# Altium project Hydroscope.PrjPcb (part 1 of 3)
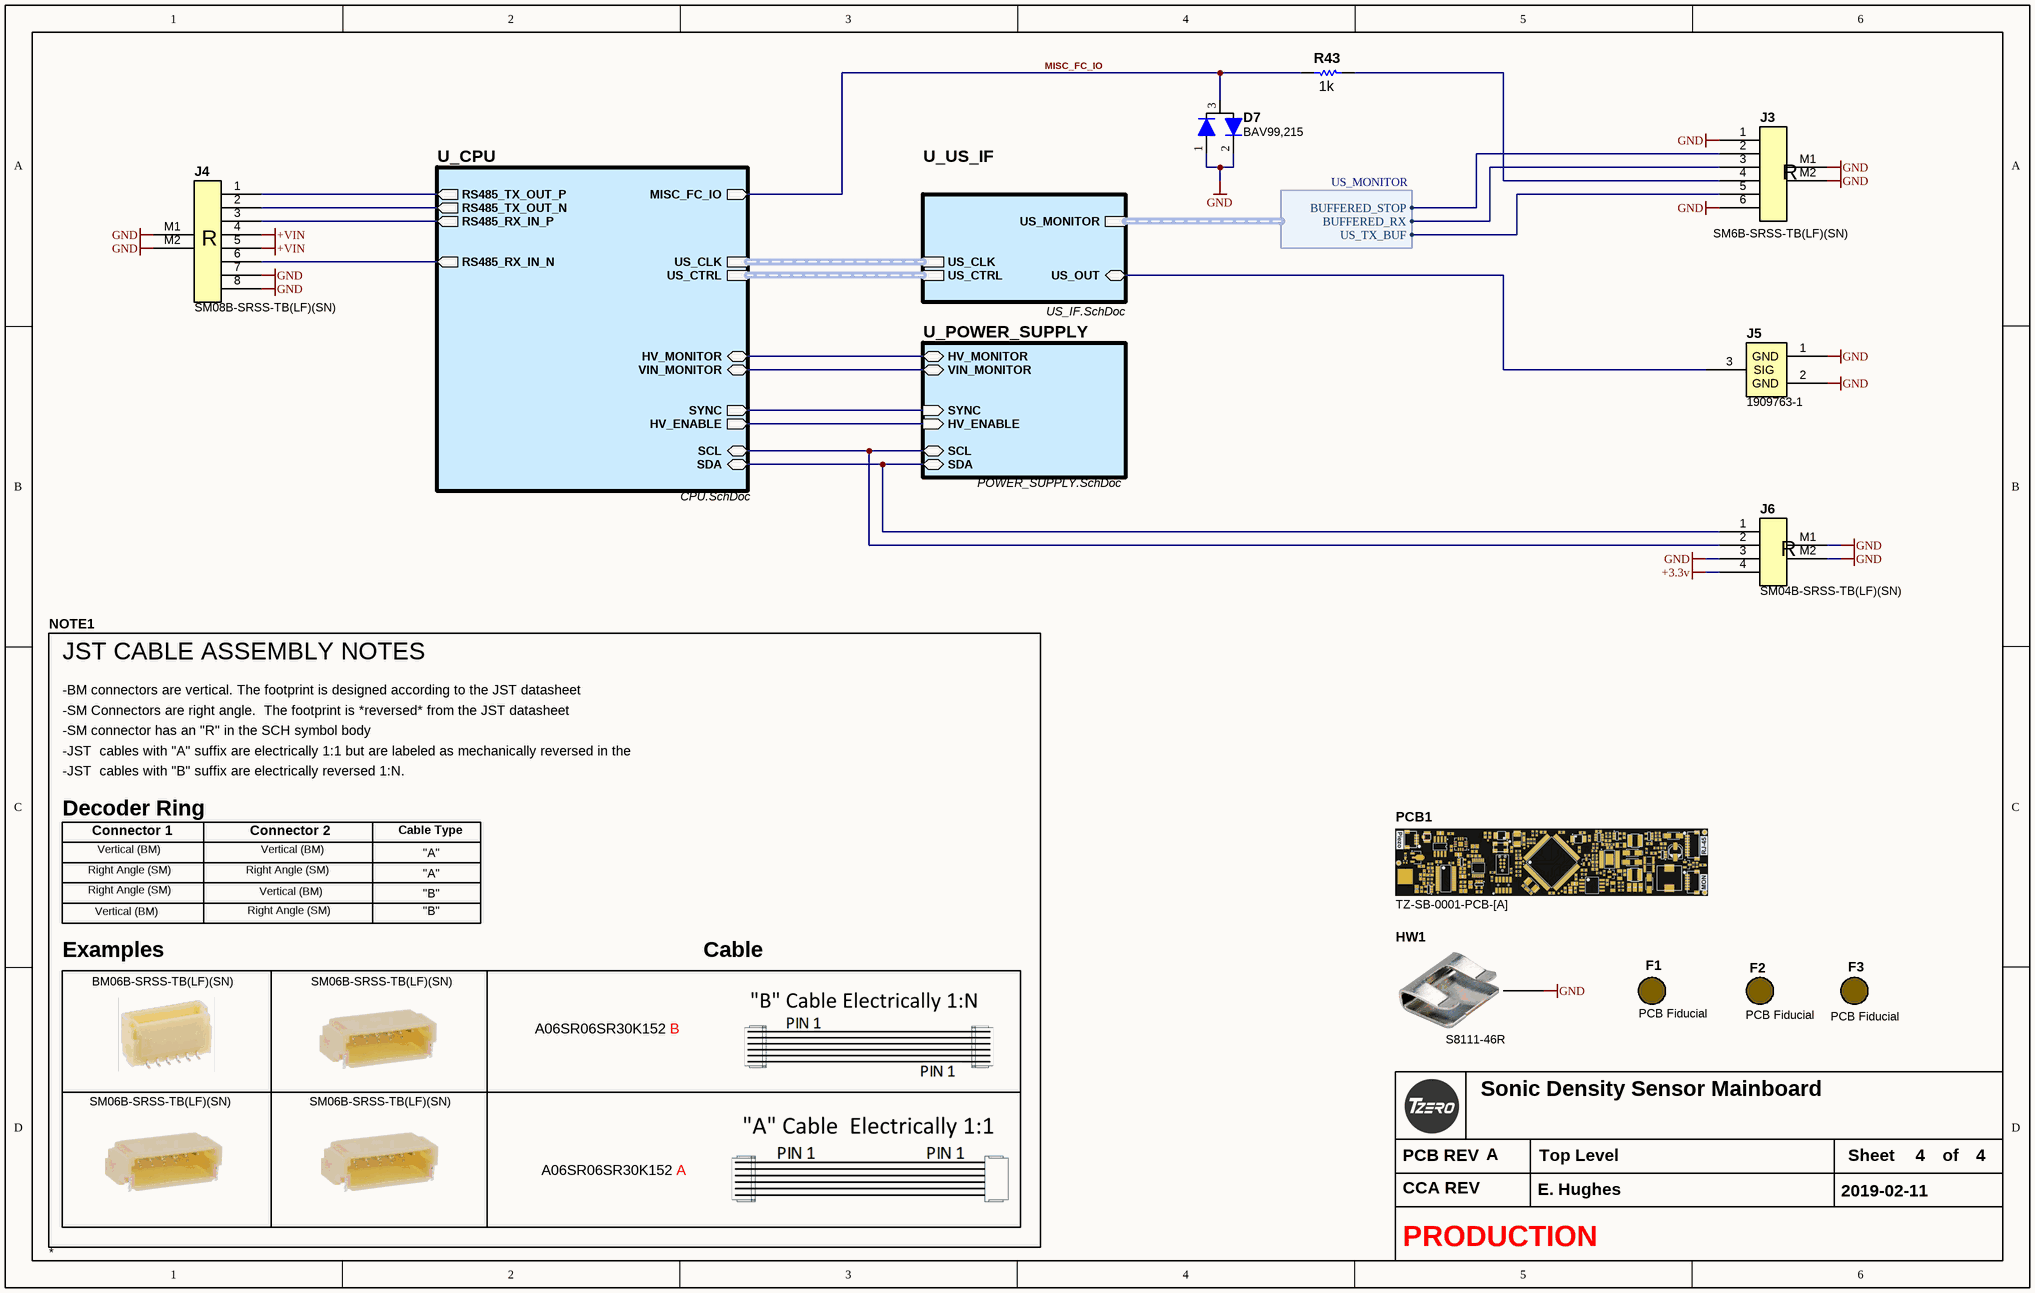
[diagram p0: TOP_LEVEL.SchDoc]
APPROVAL_APPROVED_1: -; APPROVAL_APPROVED_1_DATE: -; APPROVAL_APPROVED_2: -; APPROVAL_APPROVED_2_DATE: -; APPROVAL_CHECKED_DATE: -; APPROVAL_DRAWN: -; APPROVAL_DRAWN_DATE: -; APPROVAL_ENGINEER: -; APPROVAL_ENGINEER_DATE: -; APPROVAL_REVIEWED: -; APPROVAL_REVIEWED_DATE: -; BOM_NOTES_LINE_1: -; BOM_NOTES_LINE_2: -; BOM_NOTES_LINE_3: -; BOM_NOTES_LINE_4: -; CCA_PART_NUMBER: TZ-SB-0001; CCA_TITLE: Sonic Density Sensor Mainboard; PCB_COPPER_WEIGHT_INNER: 1 oz; PCB_COPPER_WEIGHT_OUTER: 1 oz; PCB_DIMENSION_X: X; PCB_DIMENSION_Y: X; PCB_DRC_DATE: X; PCB_FINISH_PLATING: GOLD ENIG; PCB_FINISHED_THICKNESS: 62.5mil; PCB_LAYERS: 4; PCB_MATERIAL: FR4; PCB_MIN_DRILL: 10mil; PCB_MIN_TRACE_SPACE: 6mil; PCB_MIN_TRACE_WIDTH: 6mil; PCB_PART_NUMBER: TZ-SB-0001-PCB; PCB_PRINTOUT_SCALE: 1:1; PCB_SILKSCREEN_COLOR_BOTTOM: WHITE; PCB_SILKSCREEN_COLOR_TOP: WHITE; PCB_SOLDER_MASK_COLOR_BOTTOM: BLACK; PCB_SOLDER_MASK_COLOR_TOP: BLACK; PCB_TITLE: Sonic Density Sensor Mainboard; PCB_VERSION: A; PROJECT_ENGINEER: E. Hughes; PROJECT_STATUS: PRODUCTION; PROJECT_TITLE_LINE_1: Sonic Density Sensor Mainboard; SCH_DATE: 2019-02-11
4 sheets, 167 parts. Net scope: hierarchical (ports join the sheet entries above them; power ports are global).
Board file: TZ-SB-0001-PCB-[A] (HydroScope Mainboard).PcbDoc
Sheets:
  TOP_LEVEL.SchDoc
    U_CPU = CPU.SchDoc
    U_US_IF = US_IF.SchDoc
    U_POWER_SUPPLY = POWER_SUPPLY.SchDoc

## Sheet TOP_LEVEL.SchDoc
size B; DocumentNumber: 1; SheetNumber: 4; SheetTotal: 4; PAGE_TITLE: Top Level

### Parts
D7  BAV99,215  [SOT-23]
F1  PCB Fiducial  [Fiducial 1mm - 2mm]  (no BOM)
F2  PCB Fiducial  [Fiducial 1mm - 2mm]  (no BOM)
F3  PCB Fiducial  [Fiducial 1mm - 2mm]  (no BOM)
HW1  S8111-46R  [S8111-46R]
J3  SM6B-SRSS-TB(LF)(SN)  [SM06B-SRSS-TB(LF)(SN)]
J4  SM08B-SRSS-TB(LF)(SN)  [SM08B-SRSS-TB(LF)(SN)]
J5  1909763-1  [1909763-1]
J6  SM04B-SRSS-TB(LF)(SN)  [SM04B-SRSS-TB(LF)(SN)]
NOTE1  *  (graphical)
PCB1  TZ-SB-0001-PCB-[A]  (mechanical)
R43  1k  [R0603_0.55MM_HD]

### Sub-sheets
U_CPU = CPU.SchDoc: SDA (bidir), HV_ENABLE (out), US_CTRL (harness US_CTRL), SYNC (out), US_CLK (harness US_CLK), SCL (bidir), RS485_TX_OUT_P (out), RS485_TX_OUT_N (out), RS485_RX_IN_N (out), RS485_RX_IN_P (out), HV_MONITOR (bidir), VIN_MONITOR (bidir), MISC_FC_IO (out)
U_POWER_SUPPLY = POWER_SUPPLY.SchDoc: HV_ENABLE (in), SYNC (in), SCL (bidir), SDA (bidir), HV_MONITOR (bidir), VIN_MONITOR (bidir)
U_US_IF = US_IF.SchDoc: US_MONITOR (harness US_MONITOR), US_CLK (harness US_CLK), US_CTRL (harness US_CTRL), US_OUT (bidir)

### Harnesses
US_MONITOR: BUFFERED_STOP, BUFFERED_RX, US_TX_BUF

### Nets
+3.3v: J6.4
+VIN: J4.4 J4.5
GND: D7.1(A) D7.2(C) HW1.1 J3.1 J3.6 J3.M1 J3.M2 J4.7 J4.8 J4.M1 J4.M2 J5.1(GND) J5.2(GND) J6.3 J6.M1 J6.M2
BUFFERED_RX: J3.3 ; sheet U_US_IF/US_MONITOR.BUFFERED_RX
BUFFERED_STOP: J3.2 ; sheet U_US_IF/US_MONITOR.BUFFERED_STOP
DC_DC_SYNC: sheet U_CPU/SYNC, sheet U_POWER_SUPPLY/SYNC
HV_ENABLE: sheet U_CPU/HV_ENABLE, sheet U_POWER_SUPPLY/HV_ENABLE
HV_MONITOR: sheet U_CPU/HV_MONITOR, sheet U_POWER_SUPPLY/HV_MONITOR
MISC_FC_IO: D7.3(AC) R43.2 ; sheet U_CPU/MISC_FC_IO
RS485_RX_IN_N: J4.6 ; sheet U_CPU/RS485_RX_IN_N
RS485_RX_IN_P: J4.3 ; sheet U_CPU/RS485_RX_IN_P
RS485_TX_OUT_N: J4.2 ; sheet U_CPU/RS485_TX_OUT_N
RS485_TX_OUT_P: J4.1 ; sheet U_CPU/RS485_TX_OUT_P
SCL: J6.2 ; sheet U_CPU/SCL, sheet U_POWER_SUPPLY/SCL
SDA: J6.1 ; sheet U_CPU/SDA, sheet U_POWER_SUPPLY/SDA
US_OUT: J5.3(SIG) ; sheet U_US_IF/US_OUT
US_TX_BUF: J3.5 ; sheet U_US_IF/US_MONITOR.US_TX_BUF
VIN_MONITOR: sheet U_CPU/VIN_MONITOR, sheet U_POWER_SUPPLY/VIN_MONITOR
NetJ3_4: J3.4 R43.1

### Buses and harness runs
harness sheet U_CPU/US_CLK = sheet U_US_IF/US_CLK
harness sheet U_CPU/US_CTRL = sheet U_US_IF/US_CTRL

### Notes on the sheet
- PCB REV
- Sheet
- of
- CCA REV
- (in symbol JST_SH_CABLE_ASSEMBLY_NOTES) JST CABLE ASSEMBLY NOTES; -BM connectors are vertical. The footprint is designed according to the JST datasheet; -SM Connectors are right angle.  The footprint is *reversed* from the JST datasheet; -SM connector has an "R" in the SCH symbol body; -JST  cables with "A" suffix are electrically 1:1 but are labeled as mechanically reversed in the; -JST  cables with "B" suffix are electrically reversed 1:N.; Decoder Ring; Cable Type; Connector 1; Connector 2; Vertical (BM); "A"; Right Angle (SM); "B"; Examples; Cable; BM06B-SRSS-TB(LF)(SN); SM06B-SRSS-TB(LF)(SN); A06SR06SR30K152; B; A
- (in symbol SM04B-SRSS-TB(LF)(SN)) R
- (in symbol SM06B-SRSS-TB(LF)(SN)) R
- (in symbol SM08B-SRSS-TB(LF)(SN)) R

### Library data of the parts
D7 = BAV99,215: DIODE ARRAY GP 100V 215MA SOT23; Manufacturer: NXP Semiconductors; Peak Non-Repetitive Surge Current: 4A; Reverse Recovery Time: 4ns; Peak Reverse Current: 500nA; Forward Voltage: 1.25V; Power Dissipation: 250mW; Max Power Dissipation: 250W; Breakdown Voltage: 75V; Supplier 1: Digi-Key; Supplier Part Number 1: 954-BAV99215-CHP; Manufacturer Part Number: BAV99,215; Stock 1: 0; Mount: Surface Mount; Case/Package: TO-236-3; Number of Pins: 3; Weight: 0.01lb; Contact Plating: Tin,Matte; Min Operating Temperature: -65°C; Max Operating Temperature: 150°C; Packaging: Tape and Reel; Forward Current: 215mA; Max Repetitive Reverse Voltage (Vrrm): 100V; Max Surge Current: 4A; Package Quantity: 1; Recovery Time: 4ns; Average Rectified Current: 215mA; Max Forward Surge Current (Ifsm): 4A; Termination: SMD/SMT; Voltage: 100V; Max Reverse Voltage (DC): 100V; Length: 0.25inch; Height: 0.25inch; Width: 0.25inch; Lead Free: Lead Free; REACH SVHC: No SVHC; ComponentLink1URL: https://datasheet.ciiva.com/33728/953882-33728752.pdf; ComponentLink1Description: https://datasheet.ciiva.com/33728/953882-33728752.pdf; ComponentLink2URL: https://datasheet.ciiva.com/904/bav99-ser-904513.pdf; ComponentLink2Description: https://datasheet.ciiva.com/904/bav99-ser-904513.pdf; ComponentLink3URL: https://datasheet.ciiva.com/4434/bav99-ser-4434805.pdf; ComponentLink3Description: https://datasheet.ciiva.com/4434/bav99-ser-4434805.pdf; ComponentLink4URL: https://datasheet.ciiva.com/16474/bav99-ser-16474903.pdf; ComponentLink4Description: https://datasheet.ciiva.com/16474/bav99-ser-16474903.pdf; ComponentLink5URL: https://datasheet.ciiva.com/22628/953882-22628007.pdf; ComponentLink5Description: https://datasheet.ciiva.com/22628/953882-22628007.pdf; ComponentLink6URL: https://datasheet.ciiva.com/36858/953882-36858552.pdf; ComponentLink6Description: https://datasheet.ciiva.com/36858/953882-36858552.pdf; ComponentLink7URL: https://datasheet.ciiva.com/904/bav99-ser-904509.pdf; ComponentLink7Description: https://datasheet.ciiva.com/904/bav99-ser-904509.pdf; ComponentLink8URL: https://datasheet.ciiva.com/904/bav99-ser-904511.pdf; ComponentLink8Description: https://datasheet.ciiva.com/904/bav99-ser-904511.pdf; Value: BAV99,215
F1-F3 = Fiducial: Value: PCB Fiducial
HW1 = S8111-46R: CBL CLIP 1-1.5MM DIA CBL SMD; Manufacturer: Harwin; Wire/Cable Colour: Grey; Material Thickness: 0.008inch; Value: S8111-46R; Supplier 1: Digi-Key; Supplier Part Number 1: 952-1577-1-ND; Manufacturer Part Number: S8111-46R; Stock 1: 36199; Pricing 1: 1=0.27, 10=0.254, 25=0.218, 50=0.1852, 100=0.1779, 250=0.15972, 500=0.15246 (USD); Mount: Solder; Colour: Natural,Silver; Material: Bronze,Copper,Tin; Package Quantity: 1500; Packaging: Tape and Reel; Length: 5mm; Height: 0.081inch; Width: 5mm; Depth: 5mm; REACH SVHC: No SVHC; ComponentLink1URL: https://datasheet.ciiva.com/73/s8111r-73504.pdf; ComponentLink1Description: https://datasheet.ciiva.com/73/s8111r-73504.pdf; ComponentLink2URL: https://datasheet.ciiva.com/5230/s8111r-65574-5230384.pdf; ComponentLink2Description: https://datasheet.ciiva.com/5230/s8111r-65574-5230384.pdf; ComponentLink3URL: https://datasheet.ciiva.com/73/s8111r-73505.pdf; ComponentLink3Description: https://datasheet.ciiva.com/73/s8111r-73505.pdf; ComponentLink4URL: https://datasheet.ciiva.com/1515/1694708-1515016.pdf; ComponentLink4Description: https://datasheet.ciiva.com/1515/1694708-1515016.pdf; ComponentLink5URL: https://datasheet.ciiva.com/30474/0900766b81270b7b-30474510.pdf; ComponentLink5Description: https://datasheet.ciiva.com/30474/0900766b81270b7b-30474510.pdf; Orientation: Straight; Radiation Hardening: No
J3 = SM06B-SRSS-TB(LF)(SN): 6 Positions Header, Shrouded Connector 0.039" (1.00mm) Surface Mount, Right Angle Tin; Manufacturer: JST; Number of Positions: 6; Connector Type: Male Pin; Current Rating: 1A; Voltage Rating: 50V; Contact Resistance: 40mR; Insulation Resistance: 100MR; Gender: Male; Pitch: 1mm; Value: SM6B-SRSS-TB(LF)(SN); Supplier 1: Digi-Key; Supplier Part Number 1: 455-1806-1-ND; Manufacturer Part Number: SM06B-SRSS-TB(LF)(SN); Stock 1: 40560; Pricing 1: 1=0.83, 10=0.782, 100=0.5996, 500=0.5214, 1000=0.4301 (USD); Mount: Surface Mount; Contact Material: Copper,Copper Alloy; Contact Plating: Copper,Tin,Lead; Colour: Natural; Housing Colour: Beige; Housing Material: Polyamide; Material: Polyamide; Min Operating Temperature: -25°C; Max Operating Temperature: 85°C; Number of Rows: 1; Packaging: Tape and Reel; Termination: Solder; Number of Contacts: 6; Orientation: Right Angle; Voltage Rating (AC): 50V; Max Current Rating: 1A; Max Voltage Rating (AC): 50V; Max Voltage Rating (DC): 50V; Length: 8mm; Lead Pitch: 1mm; Depth: 4.95mm; Lead Free: Lead Free; REACH SVHC: No SVHC; Flammability Rating: UL94 V-0; ComponentLink1URL: https://datasheet.ciiva.com/11752/0900766b8082f544-11752176.pdf; ComponentLink1Description: https://datasheet.ciiva.com/11752/0900766b8082f544-11752176.pdf; ComponentLink2URL: https://datasheet.ciiva.com/16217/sm06b-srss-tblfsn-16217552.pdf; ComponentLink2Description: https://datasheet.ciiva.com/16217/sm06b-srss-tblfsn-16217552.pdf; ComponentLink3URL: https://datasheet.ciiva.com/26894/getdatasheetpartid-490708-26894951.pdf; ComponentLink3Description: https://datasheet.ciiva.com/26894/getdatasheetpartid-490708-26894951.pdf; ComponentLink4URL: https://datasheet.ciiva.com/26894/getdatasheetpartid-639890-26894680.pdf; ComponentLink4Description: https://datasheet.ciiva.com/26894/getdatasheetpartid-639890-26894680.pdf; ComponentLink5URL: https://datasheet.ciiva.com/8052/91630-8052281.pdf; ComponentLink5Description: https://datasheet.ciiva.com/8052/91630-8052281.pdf; ComponentLink6URL: https://datasheet.ciiva.com/712/esr-712571.pdf; ComponentLink6Description: https://datasheet.ciiva.com/712/esr-712571.pdf; ComponentLink7URL: https://datasheet.ciiva.com/712/esr-712572.pdf; ComponentLink7Description: https://datasheet.ciiva.com/712/esr-712572.pdf; ComponentLink8URL: https://datasheet.ciiva.com/730/esr-730671.pdf; ComponentLink8Description: https://datasheet.ciiva.com/730/esr-730671.pdf
J4 = SM08B-SRSS-TB(LF)(SN): 8 Positions Header, Shrouded Connector 0.039" (1.00mm) Surface Mount, Right Angle Tin; Manufacturer: JST; Number of Positions: 8; Connector Type: Male Pin; Contact Resistance: 20mR; Current Rating: 1A; Voltage Rating (AC): 50V; Insulation Resistance: 100MR; Gender: Male; Pitch: 0.039inch; Value: SM08B-SRSS-TB(LF)(SN); Supplier 1: Digi-Key; Manufacturer Part Number: SM08B-SRSS-TB(LF)(SN); Stock 1: 51779; Pricing 1: 1=0.9, 10=0.793, 100=0.6838, 500=0.55948, 1000=0.49731 (USD); Mount: Surface Mount; Colour: Natural; Contact Plating: Tin,Lead; Contact Material: Copper,Copper Alloy; Housing Colour: Natural; Housing Material: Nylon; Material: Polyamide; Min Operating Temperature: -25°C; Max Operating Temperature: 85°C; Packaging: Tape and Reel; Number of Rows: 1; Termination: Solder; Number of Contacts: 8; Orientation: Right Angle; Voltage Rating: 50V; Lead Pitch: 1mm; Lead Free: Lead Free; REACH SVHC: No SVHC; Flammability Rating: UL94 V-0; ComponentLink1URL: https://datasheet.ciiva.com/712/esr-712599.pdf; ComponentLink1Description: https://datasheet.ciiva.com/712/esr-712599.pdf; ComponentLink2URL: https://datasheet.ciiva.com/712/esr-712600.pdf; ComponentLink2Description: https://datasheet.ciiva.com/712/esr-712600.pdf; ComponentLink3URL: https://datasheet.ciiva.com/8052/91630-8052285.pdf; ComponentLink3Description: https://datasheet.ciiva.com/8052/91630-8052285.pdf; ComponentLink4URL: https://datasheet.ciiva.com/729/esr-729838.pdf; ComponentLink4Description: https://datasheet.ciiva.com/729/esr-729838.pdf; ComponentLink5URL: https://datasheet.ciiva.com/11752/0900766b8082f54b-11752174.pdf; ComponentLink5Description: https://datasheet.ciiva.com/11752/0900766b8082f54b-11752174.pdf; ComponentLink6URL: https://datasheet.ciiva.com/16487/esr-16487087.pdf; ComponentLink6Description: https://datasheet.ciiva.com/16487/esr-16487087.pdf; Supplier Part Number 1: 455-1808-1-ND
J5 = 1909763-1: CONN UMCC JACK STR 50OHM SMD; Manufacturer: TE Connectivity AMP Connectors; Connector Style: Ultra Miniature Coaxial; Connector Type: Jack, Male Pin; Contact Termination: Solder; Body Material: Copper Alloy; Body Finish: Gold; Dielectric Material: Liquid Crystal Polymer (LCP); Voltage Rating: 60V; Mating Cycles: 30; Insertion Loss: 0.24dB; Value: 1909763-1; Supplier 1: Digi-Key; Supplier Part Number 1: A118077CT-ND; Manufacturer Part Number: 1909763-1; RoHS: RoHS Compliant; Category: Connectors, Interconnects; Stock 1: 75031; Pricing 1: 1=0.49, 10=0.462, 25=0.416, 50=0.3696, 100=0.3542, 250=0.3234, 500=0.308, 1000=0.2541, 2500=0.231 (USD); Packaging: Cut Tape (CT); Part Status: Active; Shield Termination: Solder; Impedance: 50 Ohm; Mounting Type: Surface Mount; Mounting Feature: -; Cable Group: -; Fastening Type: Snap-On; Features: -; Housing Color: Ivory; Ingress Protection: -; Includes: -; Center Contact Plating: Gold; Operating Temperature: -40°C ~ 90°C; Center Contact Material: Copper Alloy; ComponentLink1URL: http://www.te.com/commerce/DocumentDelivery/DDEController?Action=srchrtrv&DocNm=1909763&DocType=Customer+Drawing&DocLang=English; ComponentLink1Description: http://www.te.com/commerce/DocumentDelivery/DDEController?Action=srchrtrv&DocNm=1909763&DocType=Customer+Drawing&DocLang=English
J6 = SM04B-SRSS-TB(LF)(SN): Conn Shrouded Header HDR 4 POS 1mm Solder RA SMD T/R; Manufacturer: JST; Number of Positions: 4; Connector Type: Male Pin; Contact Resistance: 40mR; Max Current Rating: 1A; Max Voltage Rating (AC): 50V; Pitch: 0.039inch; Value: SM04B-SRSS-TB(LF)(SN); Supplier 1: Digi-Key; Manufacturer Part Number: SM04B-SRSS-TB(LF)(SN); Stock 1: 43886; Pricing 1: 1=0.61, 10=0.569, 100=0.436, 500=0.37914, 1000=0.31279 (USD); Mount: Surface Mount; Contact Material: Copper Alloy; Contact Plating: Copper,Tin; Colour: Natural; Housing Colour: Beige; Housing Material: Polyamide; Min Operating Temperature: -25°C; Max Operating Temperature: 85°C; Number of Rows: 1; Termination: Solder; Packaging: Tape and Reel; Orientation: Right Angle; Number of Contacts: 4; Max Voltage Rating (DC): 50V; Length: 6mm; Depth: 4.95mm; Lead Free: Lead Free; ComponentLink1URL: https://datasheet.ciiva.com/26894/getdatasheetpartid-499363-26894945.pdf; ComponentLink1Description: https://datasheet.ciiva.com/26894/getdatasheetpartid-499363-26894945.pdf; ComponentLink2URL: https://datasheet.ciiva.com/26894/getdatasheetpartid-640736-26894676.pdf; ComponentLink2Description: https://datasheet.ciiva.com/26894/getdatasheetpartid-640736-26894676.pdf; ComponentLink3URL: https://datasheet.ciiva.com/16487/jstsm04b-srss-tb-lf-sn-16487222.pdf; ComponentLink3Description: https://datasheet.ciiva.com/16487/jstsm04b-srss-tb-lf-sn-16487222.pdf; Supplier Part Number 1: 455-1804-1-ND
NOTE1 = JST_SH_CABLE_ASSEMBLY_NOTES: Value: *
PCB1 = TZ-SB-0001-PCB-[A]: Raw printed circuit board,  Revision A; Manufacturer: TZero; Value: TZ-SB-0001-PCB-[A]; Manufacturer Part Number: TZ-SB-0001-PCB-[A]
R43 = ERJ-3EKF1001V: RES 1K OHM 1/10W 1% 0603 SMD; Manufacturer: Panasonic Electronic Components; Package Power: 0603  (0.1W); Power (Watts): 0.1W- 1/10W; Temperature Coefficient: ±100ppm/°C; Limiting Element Voltage: 75; Maximum Overload Voltage: 150; Maximum Working Voltage: 10.0V; Substitution Notes: 1k , ±1% , 0603 , AEC-Q200; Value: 1k; Manufacturer Part Number: ERJ-3EKF1001V; ComponentLink1Description: Internal Datasheet; ComponentLink1URL: datasheets\Panasonic Electronic Components\AOA0000CE2.pdf; ComponentLink2Description: External Datasheet; ComponentLink2URL: http://industrial.panasonic.com/www-data/pdf/AOA0000/AOA0000CE2.pdf; Supplier 1: Digi-Key; Supplier Part Number 1: P1.00KHCT-ND; Category: Resistors; Resistance (Ohms): 1k; Composition: Thick Film; Features: -; Tolerance: ±1%; Package: 0603 (1608 Metric); Supplier Package: 0603; Size / Dimension: 0.063" L x 0.031" W (1.60mm x 0.80mm); Height: 0.55MM; Number of Terminations: 2; Packaging: Cut Tape (CT); Sort Value: 1000; Sort Value Package: 603_1000; Ratings: AEC-Q200

## Sheet CPU.SchDoc
size D; Organization: Altium Limited; Address1: 3 Minna Close; Address2: Belrose; Address3: NSW 2085; Address4: Australia; DocumentNumber: 4; SheetNumber: 1; SheetTotal: 4; PAGE_TITLE: CPU
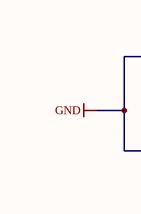
[diagram p1: CPU.SchDoc, top left]
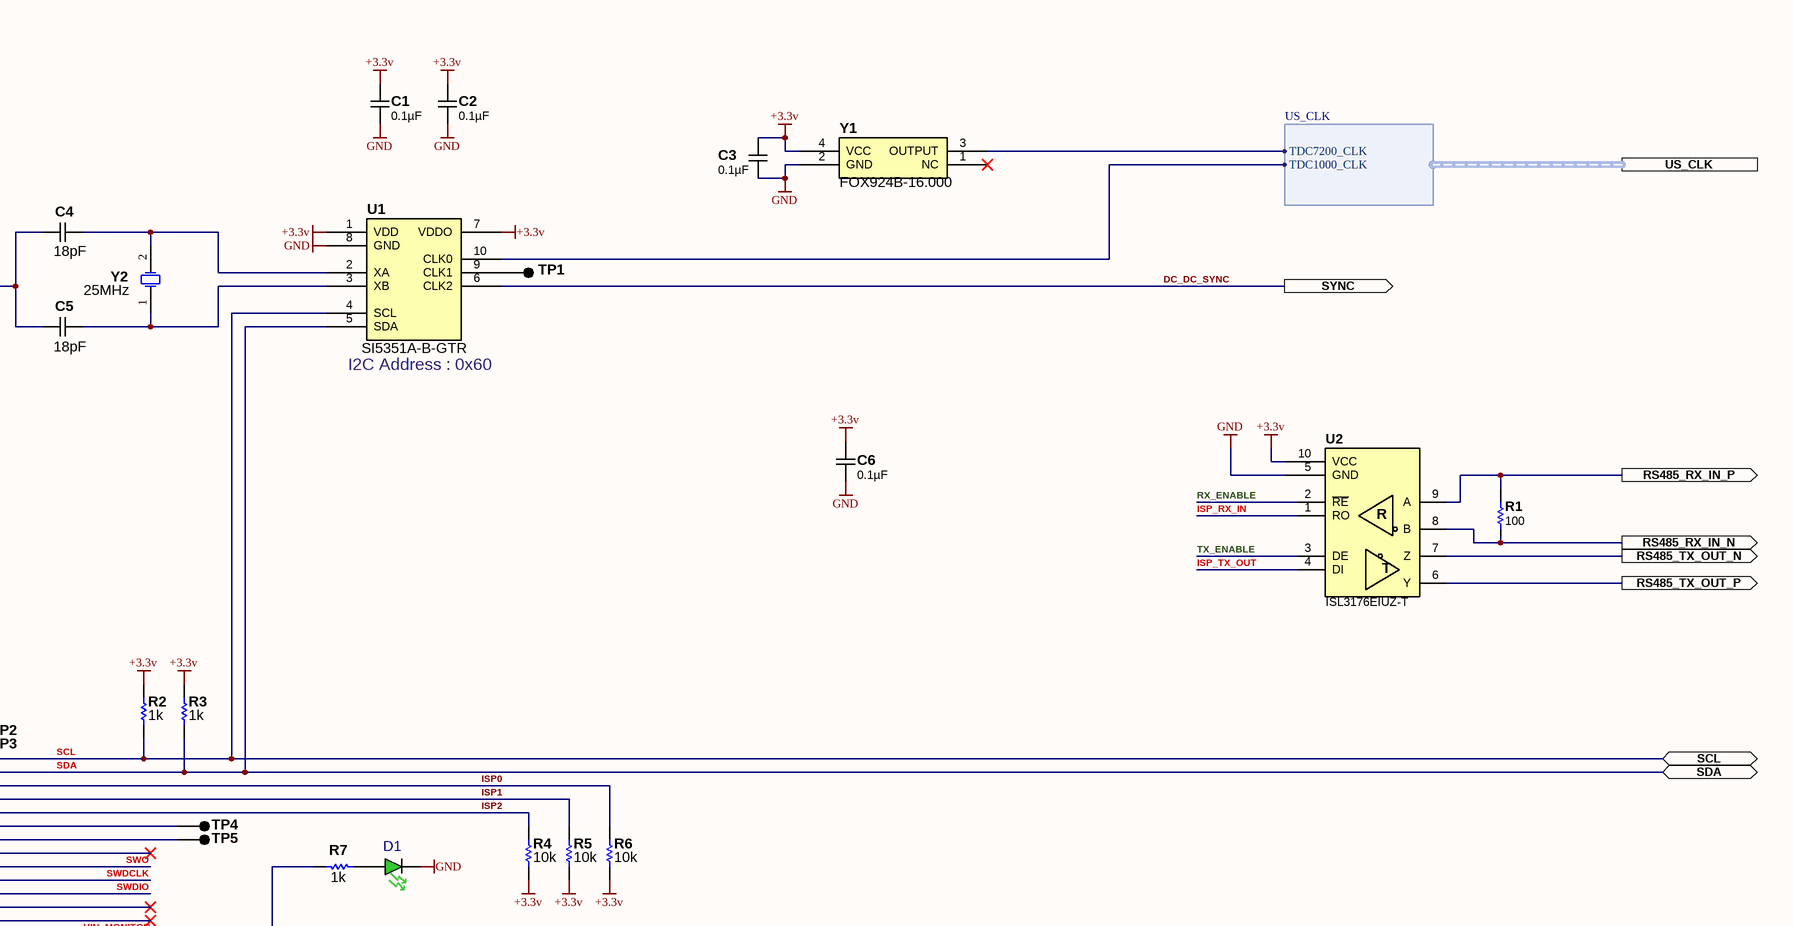
[diagram p2: CPU.SchDoc, top right]
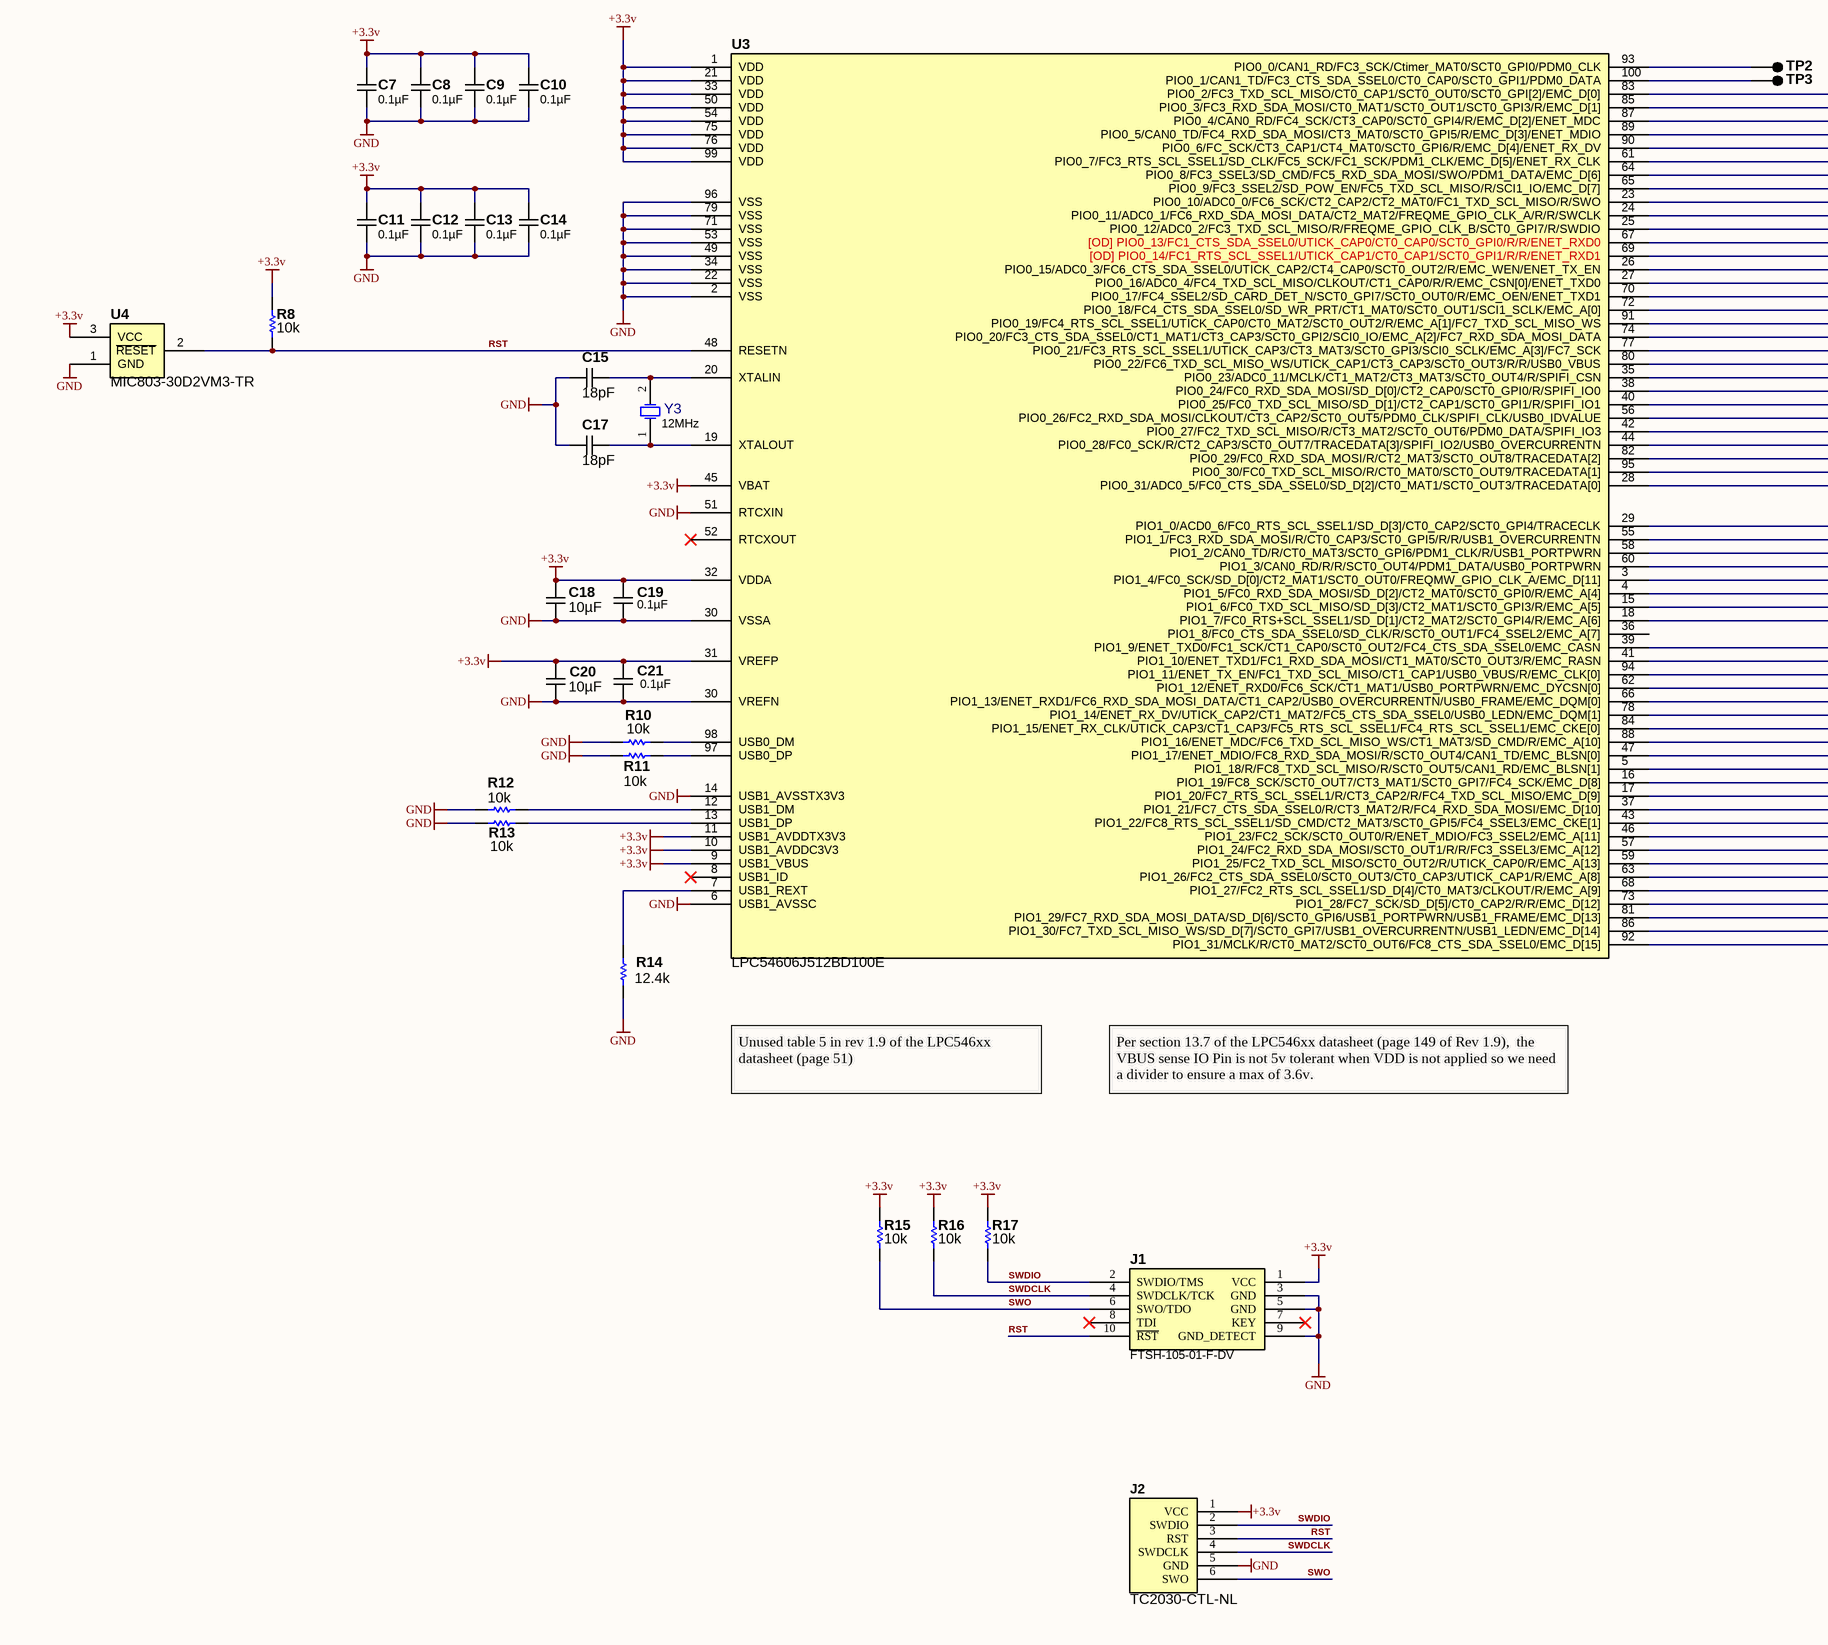
[diagram p3: CPU.SchDoc, bottom left]
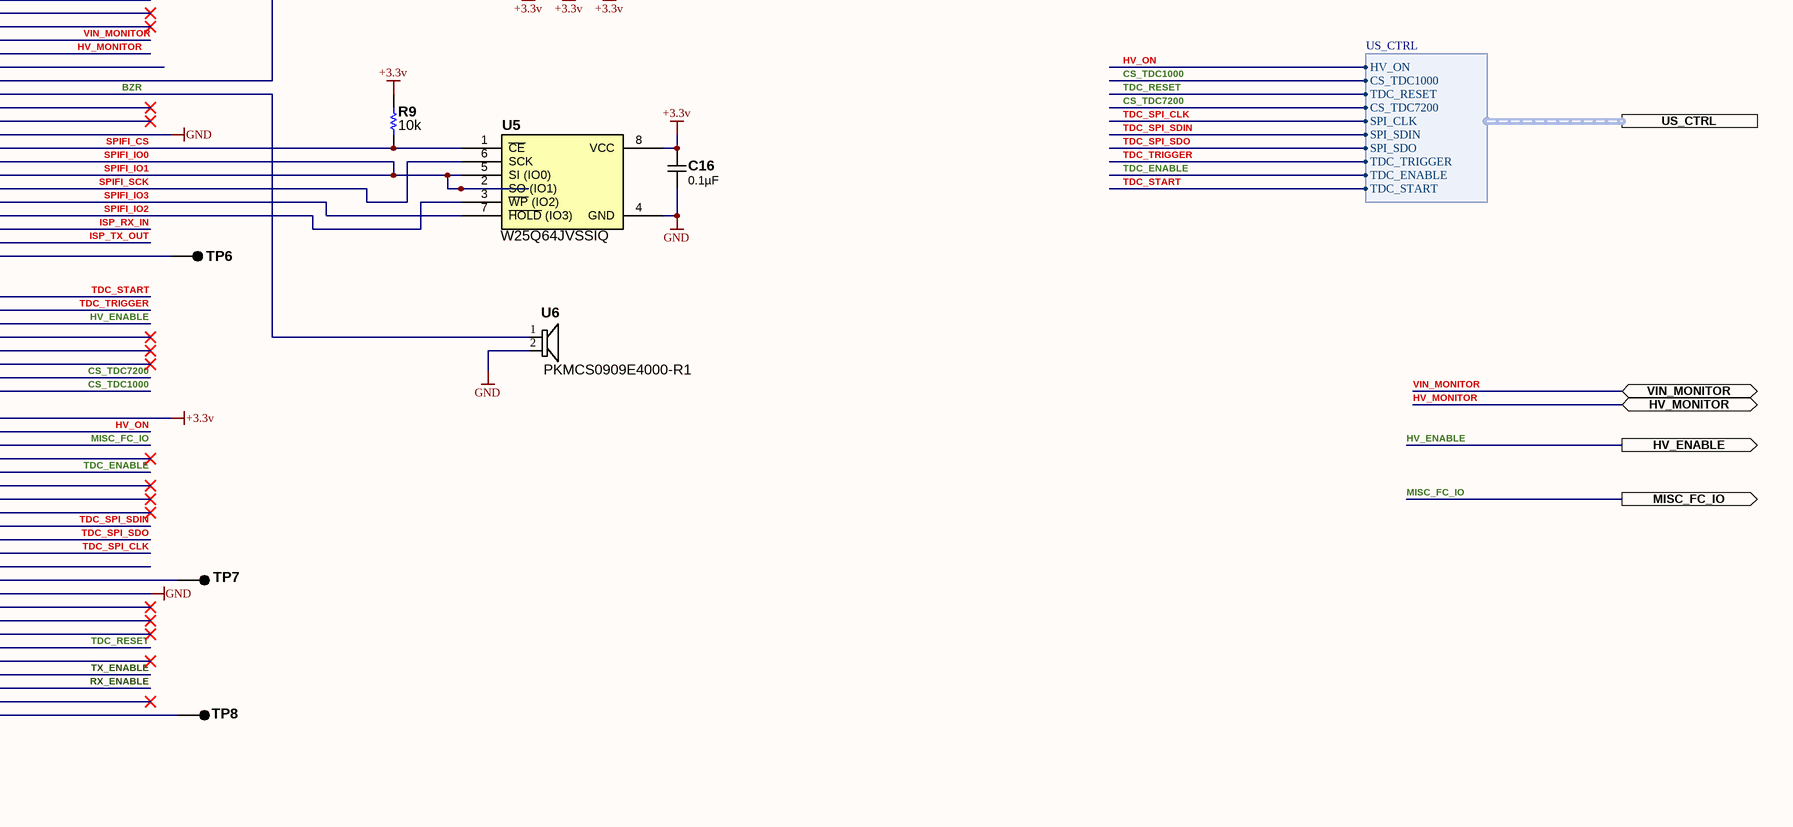
[diagram p4: CPU.SchDoc, bottom right]

### Parts
C1  0.1µF  [C0603_0.90MM_HD]
C2  0.1µF  [C0603_0.90MM_HD]
C3  0.1µF  [C0603_0.90MM_HD]
C4  18pF  [C0603_0.90MM_HD]
C5  18pF  [C0603_0.90MM_HD]
C6  0.1µF  [C0603_0.90MM_HD]
C7  0.1µF  [C0603_0.90MM_HD]
C8  0.1µF  [C0603_0.90MM_HD]
C9  0.1µF  [C0603_0.90MM_HD]
C10  0.1µF  [C0603_0.90MM_HD]
C11  0.1µF  [C0603_0.90MM_HD]
C12  0.1µF  [C0603_0.90MM_HD]
C13  0.1µF  [C0603_0.90MM_HD]
C14  0.1µF  [C0603_0.90MM_HD]
C15  18pF  [C0603_0.90MM_HD]
C16  0.1µF  [C0603_0.90MM_HD]
C17  18pF  [C0603_0.90MM_HD]
C18  10µF  [C0805_1.45MM_HD]
C19  0.1µF  [C0603_0.90MM_HD]
C20  10µF  [C0805_1.45MM_HD]
C21  0.1µF  [C0603_0.90MM_HD]
D1  LED 1.6X0.8MM 570NM GRN CLR SMD  [LED_0603 - GREEN]  (value not drawn)
J1  FTSH-105-01-F-DV  [FTSH-105-04-F-DV - HD]
J2  TC2030‐CTL‐NL  [TC2030 NO LATCH]  (no BOM)
R1  100  [R0603_HD]
R2  1k  [R0603_0.55MM_HD]
R3  1k  [R0603_0.55MM_HD]
R4  10k  [R0603_0.55MM_HD]
R5  10k  [R0603_0.55MM_HD]
R6  10k  [R0603_0.55MM_HD]
R7  1k  [R0603_0.55MM_HD]
R8  10k  [R0603_0.55MM_HD]
R9  10k  [R0603_0.55MM_HD]
R10  10k  [R0603_0.55MM_HD]
R11  10k  [R0603_0.55MM_HD]
R12  10k  [R0603_0.55MM_HD]
R13  10k  [R0603_0.55MM_HD]
R14  12.4k  [R0603_0.55MM_HD]
R15  10k  [R0603_0.55MM_HD]
R16  10k  [R0603_0.55MM_HD]
R17  10k  [R0603_0.55MM_HD]
TP1  SMT_TEST  [SMT_TP - 25]  (value not drawn)  (no BOM)
TP2  SMT_TEST  [SMT_TP - 25]  (value not drawn)  (no BOM)
TP3  SMT_TEST  [SMT_TP - 25]  (value not drawn)  (no BOM)
TP4  SMT_TEST  [SMT_TP - 25]  (value not drawn)  (no BOM)
TP5  SMT_TEST  [SMT_TP - 25]  (value not drawn)  (no BOM)
TP6  SMT_TEST  [SMT_TP - 25]  (value not drawn)  (no BOM)
TP7  SMT_TEST  [SMT_TP - 25]  (value not drawn)  (no BOM)
TP8  SMT_TEST  [SMT_TP - 25]  (value not drawn)  (no BOM)
U1  SI5351A-B-GTR  [10 MSOP]
U2  ISL3176EIUZ-T  [10 MSOP]
U3  LPC54606J512BD100E  [TSQFP50P1600X1600X160-100N]
U4  MIC803-30D2VM3-TR  [SOT-23]
U5  W25Q64JVSSIQ  [SOIC127P830X200-8L]
U6  PKMCS0909E4000-R1  [PKMCS0909E4000-R1]
Y1  FOX924B-16.000  [FOX924]
Y2  25MHz  [ABM3]
Y3  12MHz  [ABM3]

### Ports
HV_ENABLE (out), HV_MONITOR (bidir), MISC_FC_IO (out), RS485_RX_IN_N (out), RS485_RX_IN_P (out), RS485_TX_OUT_N (out), RS485_TX_OUT_P (out), SCL (bidir), SDA (bidir), SYNC (out), US_CLK (harness US_CLK), US_CTRL (harness US_CTRL), VIN_MONITOR (bidir)

### Harnesses
US_CTRL: HV_ON, CS_TDC1000, SPI_CLK, SPI_SDIN, SPI_SDO, CS_TDC7200, TDC_TRIGGER, TDC_ENABLE, TDC_RESET, TDC_START
US_CLK: TDC7200_CLK, TDC1000_CLK

### Nets
+3.3v: C1.2 C2.2 C3.2 C6.1 C7.2 C8.2 C9.2 C10.2 C11.2 C12.2 C13.2 C14.2 C16.2 C18.2 C19.2 C20.2 C21.2 J1.1(VCC) J2.1(VCC) R2.2 R3.2 R4.1 R5.1 R6.1 R8.2 R9.2 R15.2 R16.2 R17.2 U1.1(VDD) U1.7(VDDO) U2.10(VCC) U3.1(VDD) U3.9(USB1_VBUS) U3.10(USB1_AVDDC3V3) U3.11(USB1_AVDDTX3V3) U3.21(VDD) U3.31(VREFP) U3.32(VDDA) U3.33(VDD) U3.39(PIO1_9/ENET_TXD0/FC1_SCK/CT1_CAP0/SCT0_OUT2/FC4_CTS_SDA_SSEL0/EMC_CASN) U3.45(VBAT) U3.50(VDD) U3.54(VDD) U3.75(VDD) U3.76(VDD) U3.99(VDD) U4.3(VCC) U5.8(VCC) Y1.4(VCC)
GND: C1.1 C2.1 C3.1 C4.1 C5.1 C6.2 C7.1 C8.1 C9.1 C10.1 C11.1 C12.1 C13.1 C14.1 C15.1 C16.1 C17.1 C18.1 C19.1 C20.1 C21.1 D1.C J1.3(GND) J1.5(GND) J1.9(GND_DETECT) J2.5(GND) R10.1 R11.1 R12.1 R13.1 R14.1 U1.8(GND) U2.5(GND) U3.2(VSS) U3.6(USB1_AVSSC) U3.14(USB1_AVSSTX3V3) U3.22(VSS) U3.30(VREFN) U3.34(VSS) U3.43(PIO1_22/FC8_RTS_SCL_SSEL1/SD_CMD/CT2_MAT3/SCT0_GPI5/FC4_SSEL3/EMC_CKE[1]) U3.49(VSS) U3.51(RTCXIN) U3.53(VSS) U3.71(VSS) U3.79(VSS) U3.80(PIO0_22/FC6_TXD_SCL_MISO_WS/UTICK_CAP1/CT3_CAP3/SCT0_OUT3/R/R/USB0_VBUS) U3.96(VSS) U4.1(GND) U5.4(GND) U6.2(-) Y1.2(GND)
BZR: U3.91(PIO0_19/FC4_RTS_SCL_SSEL1/UTICK_CAP0/CT0_MAT2/SCT0_OUT2/R/EMC_A[1]/FC7_TXD_SCL_MISO_WS) U6.1(+)
CS_TDC1000: U3.18(PIO1_7/FC0_RTS+SCL_SSEL1/SD_D[1]/CT2_MAT2/SCT0_GPI4/R/EMC_A[6]) ; port US_CTRL.CS_TDC1000
CS_TDC7200: U3.15(PIO1_6/FC0_TXD_SCL_MISO/SD_D[3]/CT2_MAT1/SCT0_GPI3/R/EMC_A[5]) ; port US_CTRL.CS_TDC7200
DC_DC_SYNC: U1.6(CLK2) ; port SYNC
HV_ENABLE: U3.58(PIO1_2/CAN0_TD/R/CT0_MAT3/SCT0_GPI6/PDM1_CLK/R/USB1_PORTPWRN) ; port HV_ENABLE
HV_MONITOR: U3.27(PIO0_16/ADC0_4/FC4_TXD_SCL_MISO/CLKOUT/CT1_CAP0/R/R/EMC_CSN[0]/ENET_TXD0) ; port HV_MONITOR
HV_ON: U3.41(PIO1_10/ENET_TXD1/FC1_RXD_SDA_MOSI/CT1_MAT0/SCT0_OUT3/R/EMC_RASN) ; port US_CTRL.HV_ON
ISP0: R6.2 U3.87(PIO0_4/CAN0_RD/FC4_SCK/CT3_CAP0/SCT0_GPI4/R/EMC_D[2]/ENET_MDC)
ISP1: R5.2 U3.89(PIO0_5/CAN0_TD/FC4_RXD_SDA_MOSI/CT3_MAT0/SCT0_GPI5/R/EMC_D[3]/ENET_MDIO)
ISP2: R4.2 U3.90(PIO0_6/FC_SCK/CT3_CAP1/CT4_MAT0/SCT0_GPI6/R/EMC_D[4]/ENET_RX_DV)
ISP_RX_IN: U2.1(RO) U3.82(PIO0_29/FC0_RXD_SDA_MOSI/R/CT2_MAT3/SCT0_OUT8/TRACEDATA[2])
ISP_TX_OUT: U2.4(DI) U3.95(PIO0_30/FC0_TXD_SCL_MISO/R/CT0_MAT0/SCT0_OUT9/TRACEDATA[1])
MISC_FC_IO: U3.94(PIO1_11/ENET_TX_EN/FC1_TXD_SCL_MISO/CT1_CAP1/USB0_VBUS/R/EMC_CLK[0]) ; port MISC_FC_IO
RS485_RX_IN_N: R1.1 U2.8(B) ; port RS485_RX_IN_N
RS485_RX_IN_P: R1.2 U2.9(A) ; port RS485_RX_IN_P
RS485_TX_OUT_N: U2.7(Z) ; port RS485_TX_OUT_N
RS485_TX_OUT_P: U2.6(Y) ; port RS485_TX_OUT_P
RST: J1.10(~{RST}) J2.3(RST) R8.1 U3.48(RESETN) U4.2(~{RESET})
RX_ENABLE: U2.2(~{RE}) U3.81(PIO1_29/FC7_RXD_SDA_MOSI_DATA/SD_D[6]/SCT0_GPI6/USB1_PORTPWRN/USB1_FRAME/EMC_D[13])
SCL: R2.1 U1.4(SCL) U3.83(PIO0_2/FC3_TXD_SCL_MISO/CT0_CAP1/SCT0_OUT0/SCT0_GPI[2]/EMC_D[0]) ; port SCL
SDA: R3.1 U1.5(SDA) U3.85(PIO0_3/FC3_RXD_SDA_MOSI/CT0_MAT1/SCT0_OUT1/SCT0_GPI3/R/EMC_D[1]) ; port SDA
SPIFI_CS: R9.1 U3.35(PIO0_23/ADC0_11/MCLK/CT1_MAT2/CT3_MAT3/SCT0_OUT4/R/SPIFI_CSN) U5.1(~{CE})
SPIFI_IO0: U3.38(PIO0_24/FC0_RXD_SDA_MOSI/SD_D[0]/CT2_CAP0/SCT0_GPI0/R/SPIFI_IO0) U3.40(PIO0_25/FC0_TXD_SCL_MISO/SD_D[1]/CT2_CAP1/SCT0_GPI1/R/SPIFI_IO1) U5.2(SO_(IO1)) U5.5(SI_(IO0))  [also labelled SPIFI_IO1]
SPIFI_IO2: U3.44(PIO0_28/FC0_SCK/R/CT2_CAP3/SCT0_OUT7/TRACEDATA[3]/SPIFI_IO2/USB0_OVERCURRENTN) U5.3(~{WP}_(IO2))
SPIFI_IO3: U3.42(PIO0_27/FC2_TXD_SCL_MISO/R/CT3_MAT2/SCT0_OUT6/PDM0_DATA/SPIFI_IO3) U5.7(~{HOLD}_(IO3))
SPIFI_SCK: U3.56(PIO0_26/FC2_RXD_SDA_MOSI/CLKOUT/CT3_CAP2/SCT0_OUT5/PDM0_CLK/SPIFI_CLK/USB0_IDVALUE) U5.6(SCK)
SWDCLK: J1.4(SWDCLK/TCK) J2.4(SWDCLK) R16.1 U3.24(PIO0_11/ADC0_1/FC6_RXD_SDA_MOSI_DATA/CT2_MAT2/FREQME_GPIO_CLK_A/R/R/SWCLK)
SWDIO: J1.2(SWDIO/TMS) J2.2(SWDIO) R17.1 U3.25(PIO0_12/ADC0_2/FC3_TXD_SCL_MISO/R/FREQME_GPIO_CLK_B/SCT0_GPI7/R/SWDIO)
SWO: J1.6(SWO/TDO) J2.6(SWO) R15.1 U3.23(PIO0_10/ADC0_0/FC6_SCK/CT2_CAP2/CT2_MAT0/FC1_TXD_SCL_MISO/R/SWO)
TDC_ENABLE: U3.66(PIO1_13/ENET_RXD1/FC6_RXD_SDA_MOSI_DATA/CT1_CAP2/USB0_OVERCURRENTN/USB0_FRAME/EMC_DQM[0]) ; port US_CTRL.TDC_ENABLE
TDC_RESET: U3.63(PIO1_26/FC2_CTS_SDA_SSEL0/SCT0_OUT3/CT0_CAP3/UTICK_CAP1/R/EMC_A[8]) ; port US_CTRL.TDC_RESET
TDC_SPI_CLK: U3.16(PIO1_19/FC8_SCK/SCT0_OUT7/CT3_MAT1/SCT0_GPI7/FC4_SCK/EMC_D[8]) ; port US_CTRL.SPI_CLK  [project net SPI_CLK]
TDC_SPI_SDIN: U3.47(PIO1_17/ENET_MDIO/FC8_RXD_SDA_MOSI/R/SCT0_OUT4/CAN1_TD/EMC_BLSN[0]) ; port US_CTRL.SPI_SDIN  [project net SPI_SDIN]
TDC_SPI_SDO: U3.5(PIO1_18/R/FC8_TXD_SCL_MISO/R/SCT0_OUT5/CAN1_RD/EMC_BLSN[1]) ; port US_CTRL.SPI_SDO  [project net SPI_SDO]
TDC_START: U3.29(PIO1_0/ACD0_6/FC0_RTS_SCL_SSEL1/SD_D[3]/CT0_CAP2/SCT0_GPI4/TRACECLK) ; port US_CTRL.TDC_START  [project net START]
TDC_TRIGGER: U3.55(PIO1_1/FC3_RXD_SDA_MOSI/R/CT0_CAP3/SCT0_GPI5/R/R/USB1_OVERCURRENTN) ; port US_CTRL.TDC_TRIGGER
TX_ENABLE: U2.3(DE) U3.73(PIO1_28/FC7_SCK/SD_D[5]/CT0_CAP2/R/R/EMC_D[12])
VIN_MONITOR: U3.26(PIO0_15/ADC0_3/FC6_CTS_SDA_SSEL0/UTICK_CAP2/CT4_CAP0/SCT0_OUT2/R/EMC_WEN/ENET_TX_EN) ; port VIN_MONITOR
NetC4_2: C4.2 U1.2(XA) Y2.2(OSC2)
NetC5_2: C5.2 U1.3(XB) Y2.1(OSC1)
NetC15_2: C15.2 U3.20(XTALIN) Y3.2(OSC2)
NetC17_2: C17.2 U3.19(XTALOUT) Y3.1(OSC1)
NetD1_A: D1.A R7.1
NetR7_2: R7.2 U3.72(PIO0_18/FC4_CTS_SDA_SSEL0/SD_WR_PRT/CT1_MAT0/SCT0_OUT1/SCI1_SCLK/EMC_A[0])
NetR10_2: R10.2 U3.98(USB0_DM)
NetR11_2: R11.2 U3.97(USB0_DP)
NetR12_2: R12.2 U3.12(USB1_DM)
NetR13_2: R13.2 U3.13(USB1_DP)
NetR14_2: R14.2 U3.7(USB1_REXT)
NetTP1_1: TP1.1 U1.9(CLK1)
NetTP2_1: TP2.1 U3.93(PIO0_0/CAN1_RD/FC3_SCK/Ctimer_MAT0/SCT0_GPI0/PDM0_CLK)
NetTP3_1: TP3.1 U3.100(PIO0_1/CAN1_TD/FC3_CTS_SDA_SSEL0/CT0_CAP0/SCT0_GPI1/PDM0_DATA)
NetTP4_1: TP4.1 U3.61(PIO0_7/FC3_RTS_SCL_SSEL1/SD_CLK/FC5_SCK/FC1_SCK/PDM1_CLK/EMC_D[5]/ENET_RX_CLK)
NetTP5_1: TP5.1 U3.64(PIO0_8/FC3_SSEL3/SD_CMD/FC5_RXD_SDA_MOSI/SWO/PDM1_DATA/EMC_D[6])
NetTP6_1: TP6.1 U3.28(PIO0_31/ADC0_5/FC0_CTS_SDA_SSEL0/SD_D[2]/CT0_MAT1/SCT0_OUT3/TRACEDATA[0])
NetTP7_1: TP7.1 U3.37(PIO1_21/FC7_CTS_SDA_SSEL0/R/CT3_MAT2/R/FC4_RXD_SDA_MOSI/EMC_D[10])
NetTP8_1: TP8.1 U3.92(PIO1_31/MCLK/R/CT0_MAT2/SCT0_OUT6/FC8_CTS_SDA_SSEL0/EMC_D[15])
NetU1_10: U1.10(CLK0) ; port US_CLK.TDC1000_CLK
NetU10_5: Y1.3(OUTPUT) ; port US_CLK.TDC7200_CLK

Not connected (* = marked no-connect by the designer): J1 7(KEY)* 8(TDI)*; U3 3(PIO1_4/FC0_SCK/SD_D[0]/CT2_MAT1/SCT0_OUT0/FREQMW_GPIO_CLK_A/EMC_D[11])* 4(PIO1_5/FC0_RXD_SDA_MOSI/SD_D[2]/CT2_MAT0/SCT0_GPI0/R/EMC_A[4])* 8(USB1_ID)* 17(PIO1_20/FC7_RTS_SCL_SSEL1/R/CT3_CAP2/R/FC4_TXD_SCL_MISO/EMC_D[9]) 36(PIO1_8/FC0_CTS_SDA_SSEL0/SD_CLK/R/SCT0_OUT1/FC4_SSEL2/EMC_A[7]) 46(PIO1_23/FC2_SCK/SCT0_OUT0/R/ENET_MDIO/FC3_SSEL2/EMC_A[11])* 52(RTCXOUT)* 57(PIO1_24/FC2_RXD_SDA_MOSI/SCT0_OUT1/R/R/FC3_SSEL3/EMC_A[12])* 59(PIO1_25/FC2_TXD_SCL_MISO/SCT0_OUT2/R/UTICK_CAP0/R/EMC_A[13])* 60(PIO1_3/CAN0_RD/R/R/SCT0_OUT4/PDM1_DATA/USB0_PORTPWRN)* 62(PIO1_12/ENET_RXD0/FC6_SCK/CT1_MAT1/USB0_PORTPWRN/EMC_DYCSN[0])* 65(PIO0_9/FC3_SSEL2/SD_POW_EN/FC5_TXD_SCL_MISO/R/SCI1_IO/EMC_D[7])* 67([OD]_PIO0_13/FC1_CTS_SDA_SSEL0/UTICK_CAP0/CT0_CAP0/SCT0_GPI0/R/R/ENET_RXD0)* 68(PIO1_27/FC2_RTS_SCL_SSEL1/SD_D[4]/CT0_MAT3/CLKOUT/R/EMC_A[9])* 69([OD]_PIO0_14/FC1_RTS_SCL_SSEL1/UTICK_CAP1/CT0_CAP1/SCT0_GPI1/R/R/ENET_RXD1)* 70(PIO0_17/FC4_SSEL2/SD_CARD_DET_N/SCT0_GPI7/SCT0_OUT0/R/EMC_OEN/ENET_TXD1) 74(PIO0_20/FC3_CTS_SDA_SSEL0/CT1_MAT1/CT3_CAP3/SCT0_GPI2/SCI0_IO/EMC_A[2]/FC7_RXD_SDA_MOSI_DATA)* 77(PIO0_21/FC3_RTS_SCL_SSEL1/UTICK_CAP3/CT3_MAT3/SCT0_GPI3/SCI0_SCLK/EMC_A[3]/FC7_SCK)* 78(PIO1_14/ENET_RX_DV/UTICK_CAP2/CT1_MAT2/FC5_CTS_SDA_SSEL0/USB0_LEDN/EMC_DQM[1])* 84(PIO1_15/ENET_RX_CLK/UTICK_CAP3/CT1_CAP3/FC5_RTS_SCL_SSEL1/FC4_RTS_SCL_SSEL1/EMC_CKE[0])* 86(PIO1_30/FC7_TXD_SCL_MISO_WS/SD_D[7]/SCT0_GPI7/USB1_OVERCURRENTN/USB1_LEDN/EMC_D[14])* 88(PIO1_16/ENET_MDC/FC6_TXD_SCL_MISO_WS/CT1_MAT3/SD_CMD/R/EMC_A[10])*; Y1 1(NC)*

### Notes on the sheet
- (near U1) I2C Address : 0x60
- Unused table 5 in rev 1.9 of the LPC546xx datasheet (page 51)
- Per section 13.7 of the LPC546xx datasheet (page 149 of Rev 1.9),  the VBUS sense IO Pin is not 5v tolerant when VDD is not applied so we need a divider to ensure a max of 3.6v.
- PCB REV
- CCA REV
- Sheet
- of
- (in symbol ISL3176EIUZ-T) R; T

### Library data of the parts
C1-C3 C6-C14 C16 C19 C21 = CGA3E2X7R1H104K080AE: CAP CER 0.1UF 50V X7R 0603; Manufacturer: TDK Corporation; Tolerance: ±10%; Substitution Notes: 0.1µF , 50V , ±10% , X7R , -55°C ~ 125°C , AEC-Q200 , 0603; Value: 0.1µF; Temperature Coefficient: X7R; Manufacturer Part Number: CGA3E2X7R1H104K080AE; ComponentLink1Description: Datasheet (Internal); ComponentLink1URL: datasheets\TDK\mlcc_automotive_general_en.pdf; ComponentLink2Description: Datasheet (External); ComponentLink2URL: https://product.tdk.com/info/en/catalog/datasheets/mlcc_automotive_general_en.pdf; Supplier 1: Digikey; Supplier Part Number 1: 445-15957-1-ND; Category: Capacitors; Voltage - Rated: 50V; Operating Temperature: -55°C ~ 125°C; Ratings: AEC-Q200; Package: 0603; Thickness (Max): 0.90MM; Features: Soft Termination
C4 C5 C15 C17 = CGA3E2C0G1H180J080AA: CAP CER 18PF 50V C0G 0603; Manufacturer: TDK Corporation; Temperature Coefficient: C0G, NP0; Tolerance: ±5%; Substitution Notes: 18pF , 50V , ±5% , C0G, NP0 , -55°C ~ 125°C , AEC-Q200 , 0603; Value: 18pF; Manufacturer Part Number: CGA3E2C0G1H180J080AA; ComponentLink1Description: Datasheet (Internal); ComponentLink1URL: datasheets\TDK\mlcc_automotive_general_en.pdf; ComponentLink2Description: Datasheet (External); ComponentLink2URL: https://product.tdk.com/info/en/catalog/datasheets/mlcc_automotive_general_en.pdf; Supplier 1: Digikey; Supplier Part Number 1: 445-5631-1-ND; Category: Capacitors; Voltage - Rated: 50V; Operating Temperature: -55°C ~ 125°C; Ratings: AEC-Q200; Package: 0603; Thickness (Max): 0.90MM; Features: -
C18 C20 = CGA4J1X7R0J106K125AC: CAP CER 10UF 6.3V X7R 0805; Manufacturer: TDK Corporation; Tolerance: ±10%; Substitution Notes: 10µF , 6.3V , ±10% , X7R , -55°C ~ 125°C , AEC-Q200 , 0805; Value: 10µF; Temperature Coefficient: X7R; Manufacturer Part Number: CGA4J1X7R0J106K125AC; ComponentLink1Description: Datasheet (Internal); ComponentLink1URL: datasheets\TDK\mlcc_automotive_general_en.pdf; ComponentLink2Description: Datasheet (External); ComponentLink2URL: https://product.tdk.com/info/en/catalog/datasheets/mlcc_automotive_general_en.pdf; Supplier 1: Digikey; Supplier Part Number 1: 445-6971-1-ND; Category: Capacitors; Voltage - Rated: 6.3V; Operating Temperature: -55°C ~ 125°C; Ratings: AEC-Q200; Package: 0805; Thickness (Max): 1.45MM; Features: -
D1 = APT1608CGCK: Manufacturer: Kingbright Corp; Wavelength - Peak: 574nm; Millicandela Rating: 50mcd; Voltage - Forward (Vf) Typ: 2.1V; Viewing Angle: 120°; Color: Green; Current - Test: 20mA; Lens Type: Clear; Lens Style/Size: Rectangle with Flat Top, 1.2mm x 0.8mm; Value: LED 1.6X0.8MM 570NM GRN CLR SMD; Manufacturer Part Number: APT1608CGCK; RoHS: RoHS Compliant; Wavelength - Dominant: 570nm; Size / Dimension: 1.60mm L x 0.80mm W; Package / Case: 0603 (1608 Metric); Mounting Type: Surface Mount; Packaging: Tape & Reel (TR); Supplier 1: Digi-Key; Supplier Part Number 1: 754-1116-1-ND; Category: Optoelectronics; Stock 1: 89450; Pricing 1: 1=0.2, 10=0.153, 25=0.1224, 100=0.1105, 250=0.102, 500=0.0918 (USD); Height: 0.75mm; Luminous Flux @ Current - Test: -; ComponentLink1URL: http://www.us.kingbright.com/images/catalog/SPEC/APT1608CGCK.pdf; ComponentLink1Description: http://www.us.kingbright.com/images/catalog/SPEC/APT1608CGCK.pdf; Supplier 2: Digikey; Supplier Part Number 2: 160-2162-1-ND
J1 = CORTEX-DEBUG: SAMTEC - FTSH-105-01-F-DV - .050 X .050; Value: FTSH-105-01-F-DV; Supplier 1: Newark; Manufacturer: SAMTEC; Manufacturer Part Number: FTSH-105-01-F-DV; Category: Connectors; Stock 1: 0; Pricing 1: 1=0.974, 25000=0.835, 50000=0.774 (USD); Supplier Part Number 1: 01R3399
J2 = TC2030‐CTL‐NL: Tag Connect Pads - No latching Clips - ARM; Value: TC2030‐CTL‐NL
R1 = ERJ-3EKF1000V: RES 100 OHM 1/10W 1% 0603 SMD; Manufacturer: Panasonic Electronic Components; Package Power: 0603  (0.1W); Power (Watts): 0.1W- 1/10W; Temperature Coefficient: ±100ppm/°C; Limiting Element Voltage: 75; Maximum Overload Voltage: 150; Maximum Working Voltage: 3.2V; Substitution Notes: 100 , ±1% , 0603 , AEC-Q200; Value: 100; Manufacturer Part Number: ERJ-3EKF1000V; ComponentLink1Description: Internal Datasheet; ComponentLink1URL: datasheets\Panasonic Electronic Components\AOA0000CE2.pdf; ComponentLink2Description: External Datasheet; ComponentLink2URL: http://industrial.panasonic.com/www-data/pdf/AOA0000/AOA0000CE2.pdf; Stocked: 0; Supplier 1: Digi-Key; Supplier Part Number 1: P100HCT-ND; Category: Resistors; Resistance (Ohms): 100; Composition: Thick Film; Features: -; Tolerance: ±1%; Package: 0603 (1608 Metric); Supplier Package: 0603; Size / Dimension: 0.063" L x 0.031" W (1.60mm x 0.80mm); Height: 0.55MM; Number of Terminations: 2; Packaging: Cut Tape (CT); Sort Value: 100; Sort Value Package: 603_100; Ratings: AEC-Q200
R2 R3 R7 = ERJ-3EKF1001V: as R43 on sheet TOP_LEVEL; Value: 1k; Manufacturer Part Number: ERJ-3EKF1001V; ComponentLink1Description: Internal Datasheet; ComponentLink1URL: datasheets\Panasonic Electronic Components\AOA0000CE2.pdf; ComponentLink2Description: External Datasheet; ComponentLink2URL: http://industrial.panasonic.com/www-data/pdf/AOA0000/AOA0000CE2.pdf; Supplier 1: Digi-Key; Supplier Part Number 1: P1.00KHCT-ND; Category: Resistors; Resistance (Ohms): 1k; Composition: Thick Film; Features: -; Tolerance: ±1%; Package: 0603 (1608 Metric); Supplier Package: 0603; Size / Dimension: 0.063" L x 0.031" W (1.60mm x 0.80mm); Height: 0.55MM; Number of Terminations: 2; Packaging: Cut Tape (CT); Sort Value: 1000; Sort Value Package: 603_1000; Ratings: AEC-Q200
R4-R6 R8-R13 R15-R17 = ERJ-3EKF1002V: RES 10K OHM 1/10W 1% 0603 SMD; Manufacturer: Panasonic Electronic Components; Package Power: 0603  (0.1W); Power (Watts): 0.1W- 1/10W; Temperature Coefficient: ±100ppm/°C; Limiting Element Voltage: 75; Maximum Overload Voltage: 150; Maximum Working Voltage: 31.6V; Substitution Notes: 10k , ±1% , 0603 , AEC-Q200; Value: 10k; Manufacturer Part Number: ERJ-3EKF1002V; ComponentLink1Description: Internal Datasheet; ComponentLink1URL: datasheets\Panasonic Electronic Components\AOA0000CE2.pdf; ComponentLink2Description: External Datasheet; ComponentLink2URL: http://industrial.panasonic.com/www-data/pdf/AOA0000/AOA0000CE2.pdf; Supplier 1: Digi-Key; Supplier Part Number 1: P10.0KHCT-ND; Category: Resistors; Resistance (Ohms): 10k; Composition: Thick Film; Features: -; Tolerance: ±1%; Package: 0603 (1608 Metric); Supplier Package: 0603; Size / Dimension: 0.063" L x 0.031" W (1.60mm x 0.80mm); Height: 0.55MM; Number of Terminations: 2; Packaging: Cut Tape (CT); Sort Value: 10000; Sort Value Package: 603_10000; Ratings: AEC-Q200
R14 = ERJ-3EKF1242V: RES 12.4K OHM 1/10W 1% 0603 SMD; Manufacturer: Panasonic Electronic Components; Package Power: 0603  (0.1W); Power (Watts): 0.1W- 1/10W; Temperature Coefficient: ±100ppm/°C; Limiting Element Voltage: 75; Maximum Overload Voltage: 150; Maximum Working Voltage: 35.2V; Substitution Notes: 12.4k , ±1% , 0603 , AEC-Q200; Value: 12.4k; Manufacturer Part Number: ERJ-3EKF1242V; ComponentLink1Description: Internal Datasheet; ComponentLink1URL: datasheets\Panasonic Electronic Components\AOA0000CE2.pdf; ComponentLink2Description: External Datasheet; ComponentLink2URL: http://industrial.panasonic.com/www-data/pdf/AOA0000/AOA0000CE2.pdf; Supplier 1: Digi-Key; Supplier Part Number 1: P12.4KHCT-ND; Category: Resistors; Resistance (Ohms): 12.4k; Composition: Thick Film; Features: -; Tolerance: ±1%; Package: 0603 (1608 Metric); Supplier Package: 0603; Size / Dimension: 0.063" L x 0.031" W (1.60mm x 0.80mm); Height: 0.55MM; Number of Terminations: 2; Packaging: Cut Tape (CT); Sort Value: 12400; Sort Value Package: 603_12400; Ratings: AEC-Q200
U1 = SI5351A-B-GTR: Clock Generators & Support Products Any-Rate, Dual PLL 1 60MHz Clock 8outputs; Manufacturer: Silicon Labs; Number of Outputs: 3; Number of Circuits: 1; Max Frequency: 160MHz; Input: Crystal; PLL: Yes; Operating Supply Current: 22mA; Operating Supply Voltage: 3.3V; Max Duty Cycle: 55%; Value: SI5351A-B-GTR; Supplier 1: Digi-Key; Supplier Part Number 1: 336-3908-1-ND; Manufacturer Part Number: SI5351A-B-GTR; Stock 1: 11416; Pricing 1: 1=0.92, 25=0.8816, 100=0.8475 (USD); Mount: Surface Mount; Case/Package: MSOP; Number of Pins: 10; Min Operating Temperature: -40°C; Max Operating Temperature: 85°C; Packaging: Tape and Reel; Package Quantity: 2500; ComponentLink1URL: http://www.mouser.com/ds/2/368/Si5351-B-346869.pdf; ComponentLink1Description: http://www.mouser.com/ds/2/368/Si5351-B-346869.pdf; ComponentLink2URL: https://www.silabs.com/Support%20Documents/TechnicalDocs/Si5350-51-short.pdf; ComponentLink2Description: https://www.silabs.com/Support%20Documents/TechnicalDocs/Si5350-51-short.pdf; ComponentLink3URL: https://www.silabs.com/Support%20Documents/TechnicalDocs/Si5351-B.pdf; ComponentLink3Description: https://www.silabs.com/Support%20Documents/TechnicalDocs/Si5351-B.pdf
U2 = ISL3176EIUZ-T: IC TXRX RS422/485 20MBPS 10MSOP; Manufacturer: Intersil; Protocol: RS422, RS485; Number of Drivers/Receivers: 1/1; Duplex: Full; Voltage - Supply: 3 V ~ 3.6 V; Value: ISL3176EIUZ-T; Supplier 1: Digi-Key; Supplier Part Number 1: ISL3176EIUZ-TCT-ND; Manufacturer Part Number: ISL3176EIUZ-T; RoHS: RoHS Compliant; Category: Integrated Circuits (ICs); Stock 1: 9164; Pricing 1: 1=1.79, 10=1.61, 100=1.2944, 500=1.06348, 1000=0.88117 (USD); Packaging: Cut Tape (CT); Part Status: Active; Type: Transceiver; Data Rate: 20Mbps; Operating Temperature: -40°C ~ 85°C; Mounting Type: Surface Mount; Package / Case: 10-TFSOP, 10-MSOP (0.118", 3.00mm Width); Supplier Device Package: 10-MSOP; ComponentLink1URL: http://www.intersil.com/content/dam/intersil/documents/isl3/isl3170e-71e-72e-73e-74e-75e-76e-77e-78e.pdf; ComponentLink1Description: http://www.intersil.com/content/dam/intersil/documents/isl3/isl3170e-71e-72e-73e-74e-75e-76e-77e-78e.pdf
U3 = LPC54606J512BD100E: 32-BIT ARM CORTEX-M4; Manufacturer: NXP USA Inc.; Core Processor: ARM® Cortex®-M4; Speed: 180MHz; Connectivity: CAN, Ethernet, I²C, SPI, UART/USART, USB; Peripherals: Brown-out Detect/Reset, DMA, I²S, POR, PWM, WDT; Program Memory Size: 512KB (512K x 8); Program Memory Type: FLASH; EEPROM Size: 16K x 8; RAM Size: 200K x 8; Voltage - Supply (Vcc/Vdd): 1.71 V ~ 3.6 V; Data Converters: A/D 12x12b; Oscillator Type: Internal; Value: LPC54606J512BD100E; Supplier 1: Digi-Key; Supplier Part Number 1: 568-13456-ND; Manufacturer Part Number: LPC54606J512BD100E; RoHS: Request Inventory Verification; Category: Integrated Circuits (ICs); Stock 1: 0; Packaging: Tray; Part Status: Active; Core Size: 32-Bit; Operating Temperature: -40°C ~ 105°C (TA); Package / Case: 100-LQFP; Supplier Device Package: 100-LQFP (14x14); ComponentLink1URL: http://www.nxp.com/docs/en/data-sheet/LPC546XX.pdf; ComponentLink1Description: http://www.nxp.com/docs/en/data-sheet/LPC546XX.pdf
U4 = MIC803-30D2VM3-TR: 3-Pin Microprocessor Supervisor Circuit w/ Open-Drain Reset Output, 3 SOT-23 - T/R; Manufacturer: Microchip; Number of Voltages Monitored: 1; Reset: Active Low; Reset Timeout: 20ms; Threshold Voltage: 3V; Value: MIC803-30D2VM3-TR; Supplier 1: Digi-Key; Supplier Part Number 1: 576-3808-1-ND; Manufacturer Part Number: MIC803-30D2VM3-TR; Stock 1: 3642; Pricing 1: 1=0.3, 25=0.252, 100=0.231 (USD); Mount: Surface Mount; Case/Package: TO-236-3; Min Operating Temperature: -40°C; Max Operating Temperature: 125°C; Packaging: Cit Tape (CT); Type: Simple Reset/Power-On Reset; Lead Free: Lead Free
U5 = W25Q64JVSSIQ: NOR Flash Serial-SPI 3V 64MBit 64M x 1bit 6ns 8-Pin SOIC; Manufacturer: Winbond; Memory Type: NOR,FLASH; Frequency: 104MHz; Interface: SPI,Serial; Max Supply Voltage: 3.6V; Min Supply Voltage: 2.7V; Page Size: 256B; Density: 64MB; Address Bus Width: 24b; Value: W25Q64JVSSIQ; Supplier 1: Digi-Key; Supplier Part Number 1: W25Q64JVSSIQ-ND; Manufacturer Part Number: W25Q64JVSSIQ; Stock 1: 41923; Pricing 1: 1=1.36 (USD); Mount: Surface Mount; Case/Package: SOIC; Min Operating Temperature: -40°C; Max Operating Temperature: 85°C; Packaging: Tray; Operating Supply Voltage: 3V; Access Time: 6ns; ComponentLink1URL: http://www.winbond.com/resource-files/w25q64jv%20spi%20revg%2012142016.pdf; ComponentLink1Description: http://www.winbond.com/resource-files/w25q64jv%20spi%20revg%2012142016.pdf; ComponentLink2URL: https://www.winbond.com/resource-files/w25q64jv%20spi%20%20%20revc%2006032016%20kms.pdf; ComponentLink2Description: https://www.winbond.com/resource-files/w25q64jv%20spi%20%20%20revc%2006032016%20kms.pdf
U6 = PKMCS0909E4000-R1: Audio Indicators & Alerts Piezo Buzzer 9x9mm 4KHz 1.9mm Thickness; Manufacturer: Murata; Voltage Rating: 1.5V; Voltage Rating (DC): 12.5V; Min Supply Voltage (DC): -12.5V; Value: PKMCS0909E4000-R1; Supplier 1: Digi-Key; Supplier Part Number 1: 490-9647-1-ND; Manufacturer Part Number: PKMCS0909E4000-R1; Stock 1: 28739; Pricing 1: 1=1.96, 10=1.708, 25=1.3284, 50=1.2018, 100=1.0753, 250=1.04364, 500=1.012, 1000=0.91713 (USD); Mount: Surface Mount; Min Operating Temperature: -40°C; Max Operating Temperature: 85°C; Packaging: Tape and Reel; Package Quantity: 2000; Frequency: 4kHz; Termination: Solder; Max Supply Voltage (DC): 12.5V; Self Resonant Frequency: 4kHz; Length: 9mm; Height: 1.9mm; Width: 9mm; Depth: 9mm; Radiation Hardening: No; REACH SVHC: No SVHC; Lead Free: Lead Free; ComponentLink1URL: https://datasheet.ciiva.com/24244/pkmcs0909e4000-r1-304946-24244386.pdf; ComponentLink1Description: https://datasheet.ciiva.com/24244/pkmcs0909e4000-r1-304946-24244386.pdf
Y1 = FOX924B-16.000: OSC TCXO 16.000MHZ HCMOS SMD; Manufacturer: Fox Electronics; Load Capacitance: 15pF; Frequency Tolerance: 1.5ppm; Frequency: 16MHz; Min Supply Voltage: 3.135V; Max Supply Voltage: 3.465V; Operating Supply Voltage: 3.3V; Max Supply Current: 6mA; Frequency Stability: 2.5ppm; Value: FOX924B-16.000; Supplier 1: Digi-Key; Supplier Part Number 1: 631-1071-6-ND; Manufacturer Part Number: FOX924B-16.000; Stock 1: 18310; Pricing 1: 1=2.34, 10=2.287, 50=2.178, 100=1.9058, 500=1.8513 (USD); Mount: Surface Mount; Case/Package: SMD/SMT; Number of Pins: 4; Min Operating Temperature: -30°C; Max Operating Temperature: 85°C; Packaging: Tape and Reel; Package Quantity: 1000; Length: 0.197inch; Height: 0.059inch; Width: 0.126inch; Radiation Hardening: No; REACH SVHC: No SVHC; Lead Free: Lead Free; ComponentLink1URL: https://datasheet.ciiva.com/1368/fox924-1368419.pdf; ComponentLink1Description: https://datasheet.ciiva.com/1368/fox924-1368419.pdf; ComponentLink2URL: https://datasheet.ciiva.com/867/fox924-867140.pdf; ComponentLink2Description: https://datasheet.ciiva.com/867/fox924-867140.pdf; ComponentLink3URL: https://datasheet.ciiva.com/867/fox924-867141.pdf; ComponentLink3Description: https://datasheet.ciiva.com/867/fox924-867141.pdf; ComponentLink4URL: https://datasheet.ciiva.com/867/fox924-867142.pdf; ComponentLink4Description: https://datasheet.ciiva.com/867/fox924-867142.pdf; ComponentLink5URL: https://datasheet.ciiva.com/9318/fox924-9318182.pdf; ComponentLink5Description: https://datasheet.ciiva.com/9318/fox924-9318182.pdf; ComponentLink6URL: https://datasheet.ciiva.com/16439/fox924-16439159.pdf; ComponentLink6Description: https://datasheet.ciiva.com/16439/fox924-16439159.pdf; ComponentLink7URL: https://datasheet.ciiva.com/1360/fox924-1360459.pdf; ComponentLink7Description: https://datasheet.ciiva.com/1360/fox924-1360459.pdf; ComponentLink8URL: https://datasheet.ciiva.com/9318/fox924-9318188.pdf; ComponentLink8Description: https://datasheet.ciiva.com/9318/fox924-9318188.pdf; ComponentLink9URL: https://datasheet.ciiva.com/28454/1465427-28454605.pdf; ComponentLink9Description: https://datasheet.ciiva.com/28454/1465427-28454605.pdf
Y2 = ABM3-25.000MHZ-B4Y-T: 25MHz ±30ppm Crystal 18pF 30 Ohm -20°C ~ 70°C  Surface Mount 2-SMD, No Lead (DFN, LCC); Manufacturer: Abracon; ESR (Equivalent Series Resistance): 30R; Value: 25MHz; Supplier 1: Digi-Key; Supplier Part Number 1: 535-13587-1-ND; Manufacturer Part Number: ABM3-25.000MHZ-B4Y-T; Stock 1: 1849; Pricing 1: 1=1.09, 10=0.961, 50=0.8988, 100=0.7942, 500=0.7524 (USD); Mount: Surface Mount; Case/Package: SMD/SMT; Min Operating Temperature: -20°C; Max Operating Temperature: 70°C; Packaging: Tape and Reel; Frequency: 25MHz; Load Capacitance: 18pF; Frequency Stability: 30ppm; Frequency Tolerance: 30ppm; Length: 0.197inch; Height: 0.051inch; Width: 0.126inch; ComponentLink1URL: http://www.abracon.com/Resonators/abm3.pdf; ComponentLink1Description: http://www.abracon.com/Resonators/abm3.pdf
Y3 = ABM3-12.000MHZ-B2-T: CRYSTAL 12.000MHZ 18PF SMD; Manufacturer: Abracon Corporation; Frequency Stability: ±50ppm; Frequency Tolerance: ±20ppm; Operating Mode: Fundamental; Supplier 1: Digi-Key; Manufacturer Part Number: ABM3-12.000MHZ-B2-T; RoHS: RoHS Compliant; Category: Crystals and Oscillators; Stock 1: 22557; Pricing 1: 1=1.88, 10=1.625, 50=1.425, 100=1.125, 500=0.95 (USD); Type: MHz Crystal; Frequency: 12MHz; Load Capacitance: 18pF; Operating Temperature: -20°C ~ 70°C; Mounting Type: Surface Mount; Package / Case: 2-SMD, No Lead (DFN, LCC); Size / Dimension: 0.197" L x 0.126" W (5.00mm x 3.20mm); Height: 0.051" (1.30mm); Packaging: Cut Tape (CT); ComponentLink1URL: http://www.abracon.com/Resonators/abm3.pdf; ComponentLink1Description: http://www.abracon.com/Resonators/abm3.pdf; Supplier Part Number 1: 535-9100-1-ND; Value: 12MHz
TP1-TP8 = SMT_TEST: Value: SMT_TEST